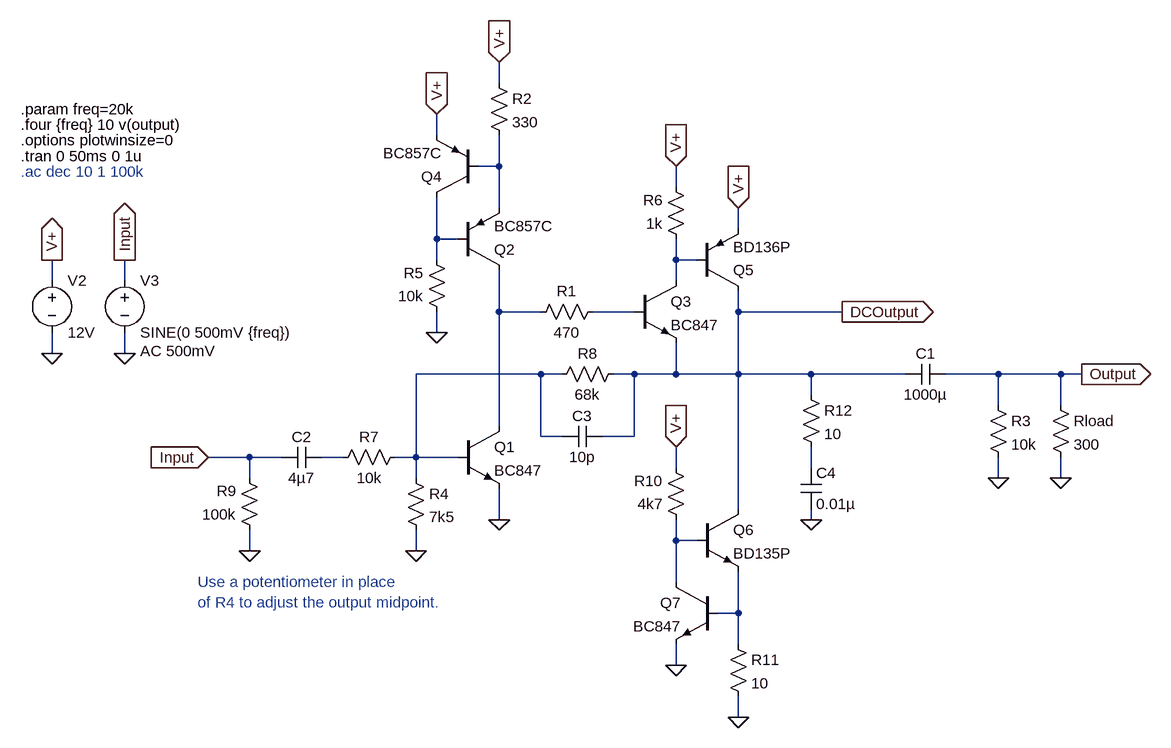
[diagram p0: schematic Headphone Amplifier (Rev A).asc]
Headphone Amplifier (Rev A).asc, the LTspice schematic file:
Version 4
SHEET 1 1552 680
WIRE 272 -352 272 -384
WIRE 176 -272 176 -304
WIRE 272 -224 272 -272
WIRE 272 -224 240 -224
WIRE 544 -192 544 -224
WIRE 272 -160 272 -224
WIRE 640 -128 640 -160
WIRE 176 -112 176 -176
WIRE 208 -112 176 -112
WIRE 176 -80 176 -112
WIRE 544 -80 544 -112
WIRE 576 -80 544 -80
WIRE -416 -48 -416 -80
WIRE -304 -48 -304 -80
WIRE 544 -48 544 -80
WIRE 272 0 272 -64
WIRE 336 0 272 0
WIRE 480 0 416 0
WIRE 640 0 640 -32
WIRE 800 0 640 0
WIRE 176 32 176 0
WIRE -416 64 -416 32
WIRE -304 64 -304 32
WIRE 336 96 144 96
WIRE 368 96 336 96
WIRE 480 96 448 96
WIRE 544 96 544 48
WIRE 544 96 480 96
WIRE 640 96 640 0
WIRE 640 96 544 96
WIRE 752 96 640 96
WIRE 896 96 752 96
WIRE 1040 96 960 96
WIRE 1136 96 1040 96
WIRE 1168 96 1136 96
WIRE 752 128 752 96
WIRE 1040 144 1040 96
WIRE 1136 144 1136 96
WIRE 272 176 272 0
WIRE 336 192 336 96
WIRE 368 192 336 192
WIRE 480 192 480 96
WIRE 480 192 432 192
WIRE -112 224 -176 224
WIRE -64 224 -112 224
WIRE 32 224 0 224
WIRE 144 224 144 96
WIRE 144 224 112 224
WIRE 208 224 144 224
WIRE 544 240 544 208
WIRE 752 240 752 208
WIRE -112 256 -112 224
WIRE 144 256 144 224
WIRE 1040 256 1040 224
WIRE 1136 256 1136 224
WIRE 640 304 640 96
WIRE 272 320 272 272
WIRE 752 320 752 304
WIRE 544 352 544 320
WIRE 576 352 544 352
WIRE -112 368 -112 336
WIRE 144 368 144 336
WIRE 544 416 544 352
WIRE 640 464 640 400
WIRE 640 464 608 464
WIRE 640 512 640 464
WIRE 544 544 544 512
WIRE 640 624 640 592
FLAG 272 320 0
FLAG 272 -384 V+
IOPIN 272 -384 In
FLAG 1168 96 Output
IOPIN 1168 96 Out
FLAG 1136 256 0
FLAG 144 368 0
FLAG -176 224 Input
IOPIN -176 224 In
FLAG -416 64 0
FLAG -304 64 0
FLAG -416 -80 V+
IOPIN -416 -80 Out
FLAG -304 -80 Input
IOPIN -304 -80 Out
FLAG 176 32 0
FLAG 640 -160 V+
IOPIN 640 -160 In
FLAG 800 0 DCOutput
IOPIN 800 0 Out
FLAG 176 -304 V+
IOPIN 176 -304 In
FLAG 544 -224 V+
IOPIN 544 -224 In
FLAG 544 208 V+
IOPIN 544 208 In
FLAG 544 544 0
FLAG 640 624 0
FLAG 1040 256 0
FLAG -112 368 0
FLAG 752 320 0
SYMBOL npn 208 176 R0
SYMATTR InstName Q1
SYMATTR Value BC847
SYMBOL res 256 -368 R0
SYMATTR InstName R2
SYMATTR Value 330
SYMBOL cap 960 80 R90
WINDOW 0 0 32 VBottom 2
WINDOW 3 32 32 VTop 2
SYMATTR InstName C1
SYMATTR Value 1000µ
SYMBOL res 1120 128 R0
SYMATTR InstName Rload
SYMATTR Value 300
SYMBOL res 128 240 R0
SYMATTR InstName R4
SYMATTR Value 7k5
SYMBOL cap 0 208 R90
WINDOW 0 0 32 VBottom 2
WINDOW 3 32 32 VTop 2
SYMATTR InstName C2
SYMATTR Value 4µ7
SYMBOL voltage -416 -64 R0
WINDOW 123 0 0 Left 0
WINDOW 39 0 0 Left 0
SYMATTR InstName V2
SYMATTR Value 12V
SYMBOL voltage -304 -64 R0
WINDOW 123 24 124 Left 2
WINDOW 39 0 0 Left 0
SYMATTR Value2 AC 500mV
SYMATTR InstName V3
SYMATTR Value SINE(0 500mV {freq})
SYMBOL pnp 208 -64 M180
SYMATTR InstName Q2
SYMATTR Value BC857C
SYMBOL res 192 16 R180
WINDOW 0 36 76 Left 2
WINDOW 3 36 40 Left 2
SYMATTR InstName R5
SYMATTR Value 10k
SYMBOL npn 480 -48 R0
SYMATTR InstName Q3
SYMATTR Value BC847
SYMBOL res 128 208 R90
WINDOW 0 0 56 VBottom 2
WINDOW 3 32 56 VTop 2
SYMATTR InstName R7
SYMATTR Value 10k
SYMBOL res 464 80 R90
WINDOW 0 0 56 VBottom 2
WINDOW 3 32 56 VTop 2
SYMATTR InstName R8
SYMATTR Value 68k
SYMBOL pnp 240 -176 R180
SYMATTR InstName Q4
SYMATTR Value BC857C
SYMBOL pnp 576 -32 M180
SYMATTR InstName Q5
SYMATTR Value BD136P
SYMBOL res 560 -96 R180
WINDOW 0 36 76 Left 2
WINDOW 3 36 40 Left 2
SYMATTR InstName R6
SYMATTR Value 1k
SYMBOL npn 576 304 R0
SYMATTR InstName Q6
SYMATTR Value BD135P
SYMBOL npn 608 416 M0
SYMATTR InstName Q7
SYMATTR Value BC847
SYMBOL res 560 336 R180
WINDOW 0 36 76 Left 2
WINDOW 3 36 40 Left 2
SYMATTR InstName R10
SYMATTR Value 4k7
SYMBOL res 624 496 R0
SYMATTR InstName R11
SYMATTR Value 10
SYMBOL res 1024 128 R0
SYMATTR InstName R3
SYMATTR Value 10k
SYMBOL res -96 352 R180
WINDOW 0 36 76 Left 2
WINDOW 3 36 40 Left 2
SYMATTR InstName R9
SYMATTR Value 100k
SYMBOL cap 432 176 R90
WINDOW 0 0 32 VBottom 2
WINDOW 3 32 32 VTop 2
SYMATTR InstName C3
SYMATTR Value 10p
SYMBOL res 432 -16 R90
WINDOW 0 0 56 VBottom 2
WINDOW 3 32 56 VTop 2
SYMATTR InstName R1
SYMATTR Value 470
SYMBOL res 736 112 R0
SYMATTR InstName R12
SYMATTR Value 10
SYMBOL cap 736 240 R0
SYMATTR InstName C4
SYMATTR Value 0.01µ
TEXT -464 -240 Left 2 !.tran 0 50ms 0 1u
TEXT -464 -264 Left 2 !.options plotwinsize=0
TEXT -464 -288 Left 2 !.four {freq} 10 v(output)
TEXT -464 -312 Left 2 !.param freq=20k
TEXT -192 416 Left 2 ;Use a potentiometer in place\nof R4 to adjust the output midpoint.
TEXT -464 -216 Left 2 ;.ac dec 10 1 100k

The netlist it stands for:
* Headphone Amplifier (Rev A).asc
Q1 N004 N006 0 0 BC847
R2 V+ N001 330
C1 Output DCOutput 1000µ
Rload Output 0 300
R4 N006 0 7k5
C2 N007 Input 4µ7
V2 V+ 0 12V
V3 Input 0 SINE(0 500mV {freq}) AC 500mV
Q2 N004 N002 N001 0 BC857C
R5 0 N002 10k
Q3 N003 N005 DCOutput 0 BC847
R7 N006 N007 10k
R8 DCOutput N006 68k
Q4 N002 N001 V+ 0 BC857C
Q5 DCOutput N003 V+ 0 BD136P
R6 N003 V+ 1k
Q6 DCOutput N009 N010 0 BD135P
Q7 N009 N010 0 0 BC847
R10 N009 V+ 4k7
R11 N010 0 10
R3 Output 0 10k
R9 0 Input 100k
C3 DCOutput N006 10p
R1 N005 N004 470
R12 DCOutput N008 10
C4 N008 0 0.01µ
.model NPN NPN
.model PNP PNP
.lib standard.bjt
.tran 0 50ms 0 1u
.options plotwinsize=0
.four {freq} 10 v(output)
.param freq=20k
* Use a potentiometer in place
* of R4 to adjust the output midpoint.
* .ac dec 10 1 100k
.backanno
.end